# EAGLE design ostc_v3 (EAGLE 6.4)
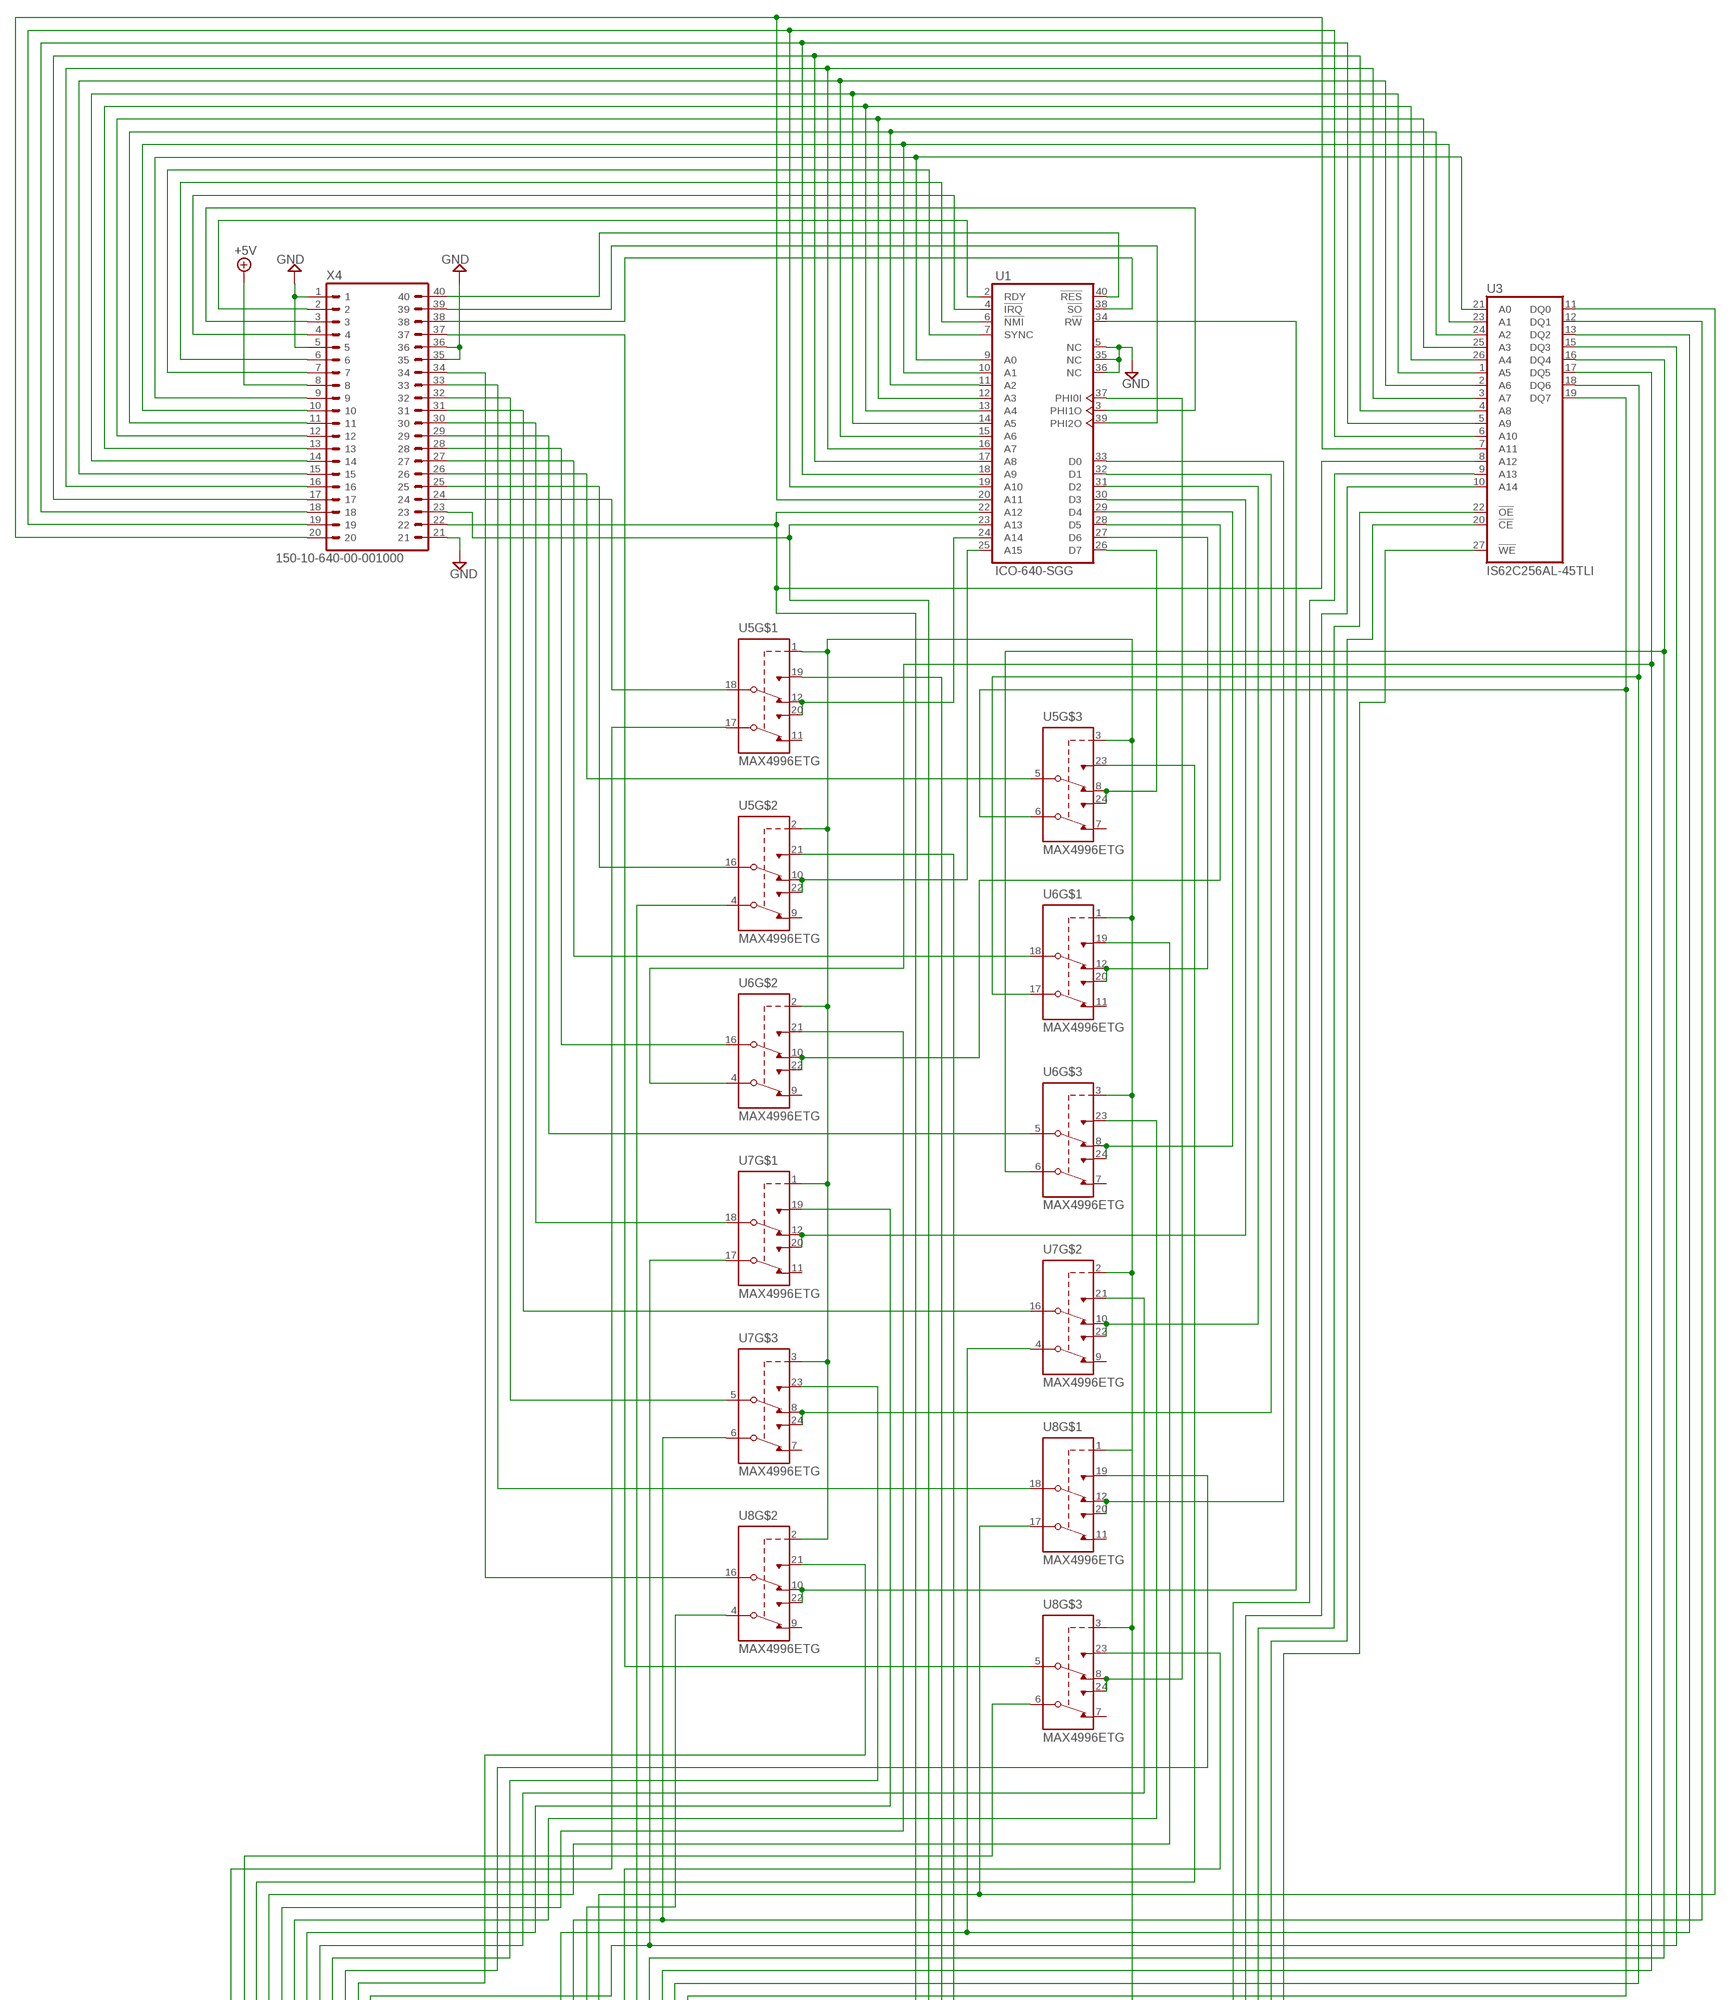
[diagram p0: schematic, sheet 1, part 1 of 2]
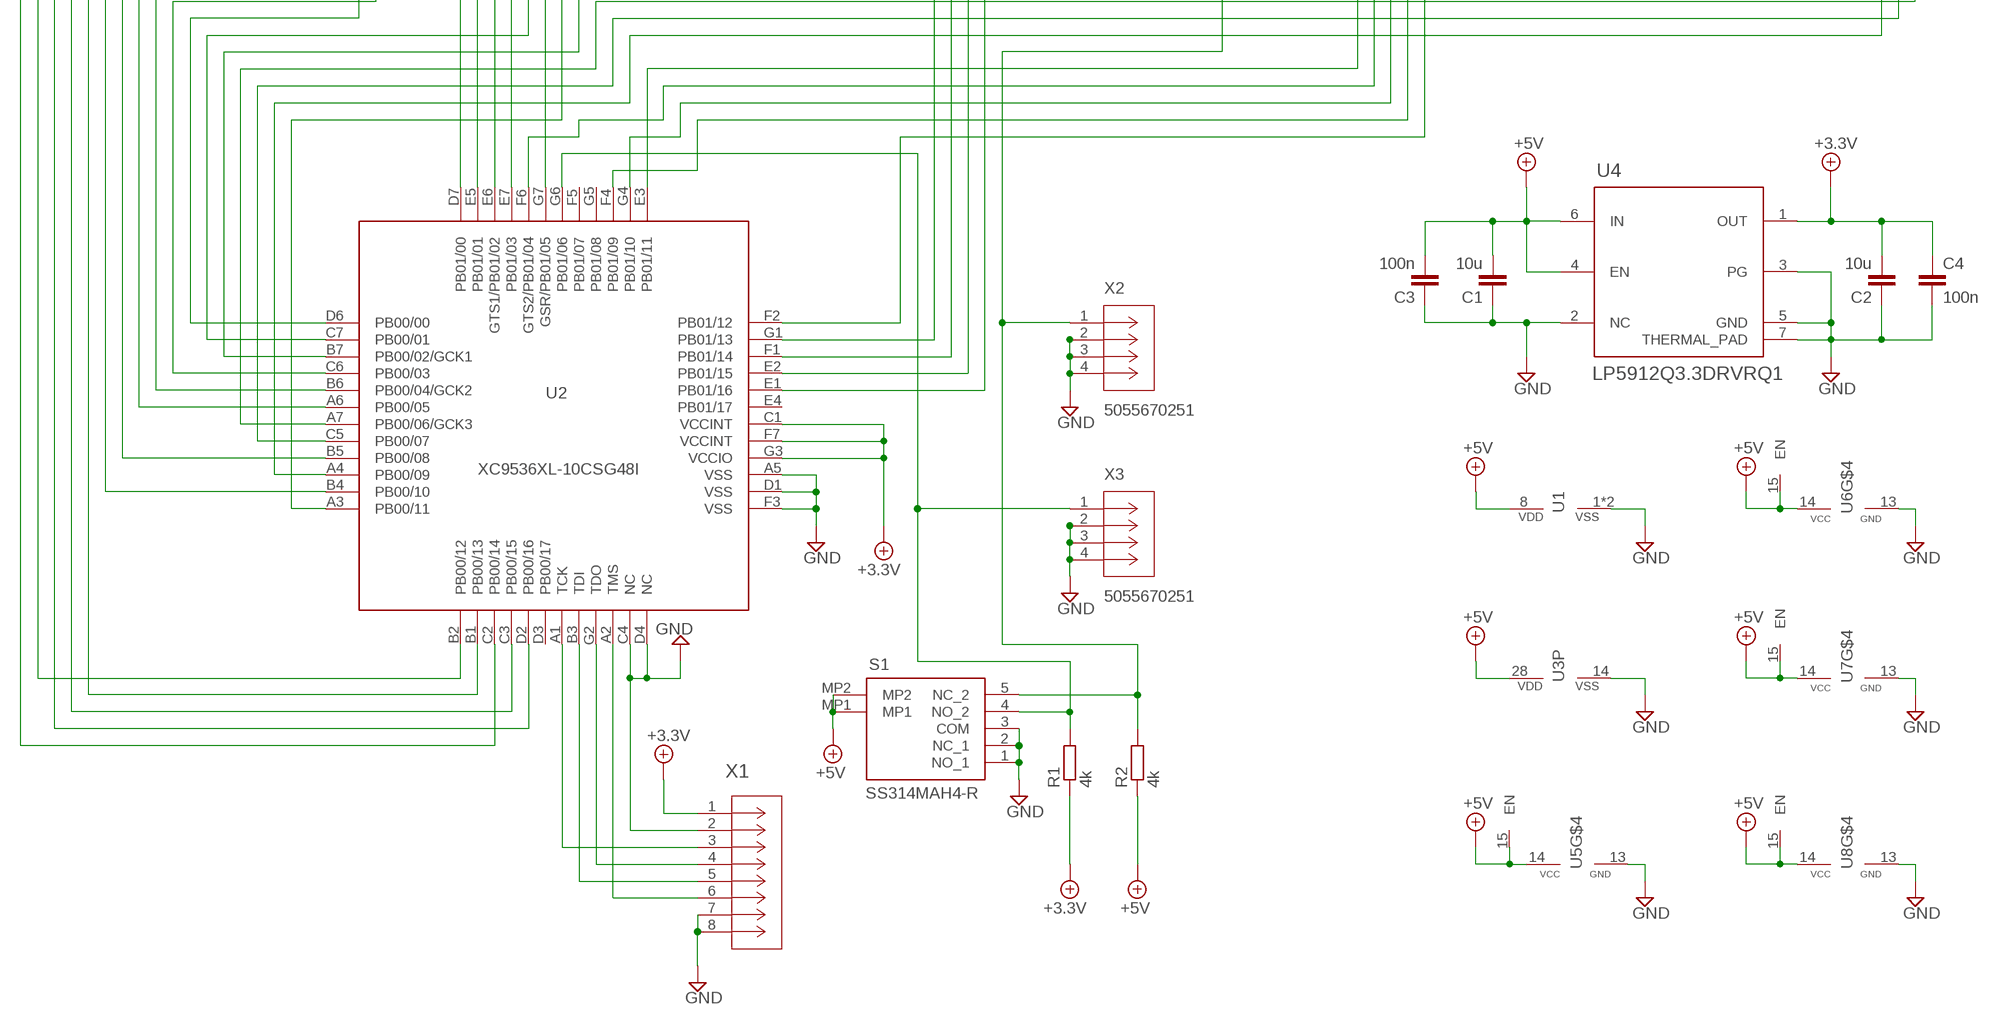
[diagram p1: schematic, sheet 1, part 2 of 2]

## Parts
C1  10u  C-EUC0805  [C0805]
C2  10u  C-EUC0805  [C0805]
C3  100n  C-EUC0805  [C0805]
C4  100n  C-EUC0805  [C0805]
R1  4k  R-EU_R0805  [R0805]
R2  4k  R-EU_R0805  [R0805]
S1  SS314MAH4-R  [SS314MAH4R]
U1  ICO-640-SGG  6502SAMTEC_ICO_C  [DIL40_MICROPROFILE]
U2  XC9536XL-10CSG48I  CX9536_CS48  [CSBGA48]
U3  IS62C256AL-45TLI  CY62256LL-ZC  [TSOP1-28]
U4  LP5912Q3.3DRVRQ1  LP5912-3.0DRVT  [DRV0006A-IPC_A]
U5  MAX4996ETG  [TQFN24]
U6  MAX4996ETG  [TQFN24]
U7  MAX4996ETG  [TQFN24]
U8  MAX4996ETG  [TQFN24]
X1  505567-0651  5055670651  [CON_5055670651]
X2  5055670251  [CON_5055670251]
X3  5055670251  [CON_5055670251]
X4  150-10-640-00-001000  DIL40  [DIL40]

## Nets
+3.3V: C2.2 C4.1 R1.1 U2.C1(VCCINT) U2.F7(VCCINT) U2.G3(VCCIO) U4.1(OUT) X1.1
+5V: C1.2 C3.2 R2.1 S1.MP1 S1.MP2 U1.8(VDD) U3.28(VDD) U4.4(EN) U4.6(IN) U5.14(VCC) U5.15(EN) U6.14(VCC) U6.15(EN) U7.14(VCC) U7.15(EN) U8.14(VCC) U8.15(EN) X4.8
GND: C1.1 C2.1 C3.1 C4.2 S1.1(NO_1) S1.2(NC_1) S1.3(COM) U1.1(VSS) U1.5(NC) U1.21(VSS) U1.35(NC) U1.36(NC) U2.A5(VSS) U2.C4(NC) U2.D1(VSS) U2.D4(NC) U2.F3(VSS) U3.14(VSS) U4.2(NC) U4.3(PG) U4.5(GND) U4.7(THERMAL_PAD) U5.13(GND) U6.13(GND) U7.13(GND) U8.13(GND) X1.2 X1.7 X1.8 X2.2 X2.3 X2.4 X3.2 X3.3 X3.4 X4.1 X4.5 X4.21 X4.35 X4.36
N$1: U1.2(RDY) X4.2
N$2: U1.3(PHI1O) X4.3
N$3: U1.4(!IRQ) X4.4
N$4: U1.6(!NMI) X4.6
N$5: U1.7(SYNC) X4.7
N$6: U1.9(A0) U3.21(A0) X4.9
N$7: U1.10(A1) U3.23(A1) X4.10
N$8: U1.11(A2) U3.24(A2) X4.11
N$9: U1.12(A3) U3.25(A3) X4.12
N$10: U1.13(A4) U3.26(A4) X4.13
N$11: U1.14(A5) U3.1(A5) X4.14
N$12: U1.15(A6) U3.2(A6) X4.15
N$13: U1.16(A7) U3.3(A7) X4.16
N$14: U1.17(A8) U3.4(A8) X4.17
N$15: U1.18(A9) U3.5(A9) X4.18
N$16: U1.19(A10) U3.6(A10) X4.19
N$17: U1.20(A11) U3.7(A11) X4.20
N$18: U2.E2(PB01/15) U5.19(NO1)
N$19: U1.22(A12) U2.G1(PB01/13) U3.8(A12) X4.22
N$20: U1.23(A13) U2.F1(PB01/14) X4.23
N$21: U2.E1(PB01/16) U5.21(NO1)
N$22: U2.D2(PB00/16) U5.23(NO1)
N$23: U2.C3(PB00/15) U6.19(NO1)
N$24: U2.B1(PB00/13) U6.21(NO1)
N$25: U2.B4(PB00/10) U6.23(NO1)
N$26: U2.B5(PB00/08) U7.19(NO1)
N$27: U2.A6(PB00/05) U7.21(NO1)
N$28: U2.B6(PB00/04/GCK2) U7.23(NO1)
N$29: U2.C6(PB00/03) U8.19(NO1)
N$30: U2.D6(PB00/00) U8.21(NO1)
N$31: U8.5(COM1) X4.37
N$32: U1.38(!SO) X4.38
N$33: U1.39(PHI2O) X4.39
N$34: U1.40(!RES) X4.40
N$35: U2.B2(PB00/12) U8.6(COM2)
N$36: U2.E6(GTS1/PB01/02) U8.4(COM2)
N$37: U2.E7(PB01/03) U3.11(DQ0) U8.17(COM2)
N$38: U2.E5(PB01/01) U3.12(DQ1) U7.6(COM2)
N$39: U2.D7(PB01/00) U3.13(DQ2) U7.4(COM2)
N$40: U2.C7(PB00/01) U3.15(DQ3) U7.17(COM2)
N$41: U2.B7(PB00/02/GCK1) U3.16(DQ4) U6.6(COM2)
N$42: U2.A7(PB00/06/GCK3) U3.17(DQ5) U6.4(COM2)
N$43: U2.C5(PB00/07) U3.18(DQ6) U6.17(COM2)
N$44: U2.A4(PB00/09) U3.19(DQ7) U5.6(COM2)
N$45: R1.2 S1.4(NO_2) U2.G6(PB01/06) X3.1
N$46: U1.24(A14) U5.12(NC1) U5.20(NO2)
N$47: U1.26(D7) U5.8(NC1) U5.24(NO2)
N$48: U5.16(COM1) X4.25
N$49: U1.25(A15) U5.10(NC1) U5.22(NO2)
N$50: U5.5(COM1) X4.26
N$51: R2.2 S1.5(NC_2) U5.1(CB) U5.2(CB) U5.3(CB) U6.1(CB) U6.2(CB) U6.3(CB) U7.1(CB) U7.2(CB) U7.3(CB) U8.1(CB) U8.2(CB) U8.3(CB) X2.1
N$52: U6.18(COM1) X4.27
N$53: U2.A3(PB00/11) U5.4(COM2)
N$54: U2.C2(PB00/14) U5.17(COM2)
N$55: U2.A2(TMS) X1.6
N$56: U2.B3(TDI) X1.5
N$57: U2.G2(TDO) X1.4
N$58: U2.A1(TCK) X1.3
N$59: U1.27(D6) U6.12(NC1) U6.20(NO2)
N$60: U5.18(COM1) X4.24
N$61: U6.16(COM1) X4.28
N$62: U1.28(D5) U6.10(NC1) U6.22(NO2)
N$63: U7.16(COM1) X4.31
N$64: U1.29(D4) U6.8(NC1) U6.24(NO2)
N$65: U6.5(COM1) X4.29
N$66: U7.18(COM1) X4.30
N$67: U1.30(D3) U7.12(NC1) U7.20(NO2)
N$68: U1.31(D2) U7.10(NC1) U7.22(NO2)
N$69: U7.5(COM1) X4.32
N$70: U1.32(D1) U7.8(NC1) U7.24(NO2)
N$71: U1.33(D0) U8.12(NC1) U8.20(NO2)
N$72: U8.18(COM1) X4.33
N$73: U8.16(COM1) X4.34
N$74: U1.34(R!W) U8.10(NC1) U8.22(NO2)
N$75: U1.37(PHI0I) U8.8(NC1) U8.24(NO2)
N$76: U2.G7(GSR/PB01/05) U8.23(NO1)
N$77: U2.E3(PB01/11) U3.9(A13)
N$78: U2.F6(GTS2/PB01/04) U3.10(A14)
N$79: U2.G4(PB01/10) U3.22(!OE)
N$80: U2.F4(PB01/09) U3.20(!CE)
N$81: U2.F2(PB01/12) U3.27(!WE)
Unconnected: U2.D3(PB00/17) U2.E4(PB01/17) U2.F5(PB01/07) U2.G5(PB01/08) U5.7(NC2) U5.9(NC2) U5.11(NC2) U6.7(NC2) U6.9(NC2) U6.11(NC2) U7.7(NC2) U7.9(NC2) U7.11(NC2) U8.7(NC2) U8.9(NC2) U8.11(NC2)

## Library data of the parts
C1-C4 = resistor:C-EU: CAPACITOR, European symbol
R1 R2 = resistor:R-EU_: RESISTOR, European symbol
S1 = SS314MAH4-R:SS314MAH4-R: Slide Switches ON-ON-ON .4VA SMT 2MM X 2MM SPACING Source: Datasheet <http://www.nkkswitches.com/pdf/SS3surfaceMount-1.pdf>; DESCRIPTION: Slide Switches ON-ON-ON .4VA SMT 2MM X 2MM SPACING; HEIGHT: 1.4mm; MANUFACTURER_NAME: NKK Switches; MANUFACTURER_PART_NUMBER: SS314MAH4-R; MOUSER_PART_NUMBER: 633-SS314MAH4-R; MOUSER_PRICE-STOCK: https://www.mouser.co.uk/ProductDetail/NKK-Switches/SS314MAH4-R?qs=ICf24S48Y%2FuhNriUiZqPNA%3D%3D
U1 = 6502:6502: R6502 by Rockwell
U2 = xilinx-xc9:CX9536_CS48
U3 = memory-sram:CY62256LL-?*: 256K (32K x 8) CMOS-Static RAM Source: http://download.cypress.com.edgesuite.net/design_resources/datasheets/contents/cy62256_8.pdf
U4 = texas:LP5912-3.0DRVT; COPYRIGHT: Copyright (C) 2024 Ultra Librarian. All rights reserved.; MANUFACTURER_PART_NUMBER: LP5912-3.0DRVT; MFR_NAME: Texas Instruments; REFDES: RefDes; TYPE: TYPE
U5-U8 = maxim:MAX4996ETG*: Triple DPDT, Low Capacitance Data Switches * No exposed pad Source: https://www.analog.com/media/en/technical-documentation/data-sheets/max4996-max4996l.pdf; MPN: MAX4996ETG+; OC_MOUSER: 700-MAX4996ETG
X1 = con-molex:5055670651; COPYRIGHT: Copyright (C) 2024 Ultra Librarian. All rights reserved.; MANUFACTURER_PART_NUMBER: 5055670651; MFR_NAME: Molex Connector Corporation
X2 X3 = con-molex:5055670251; COPYRIGHT: Copyright (C) 2024 Ultra Librarian. All rights reserved.; MANUFACTURER_PART_NUMBER: 5055670251; MFR_NAME: Molex Connector Corporation
X4 = DIL-header:DIL40: DIL Header 40-pin

## Board
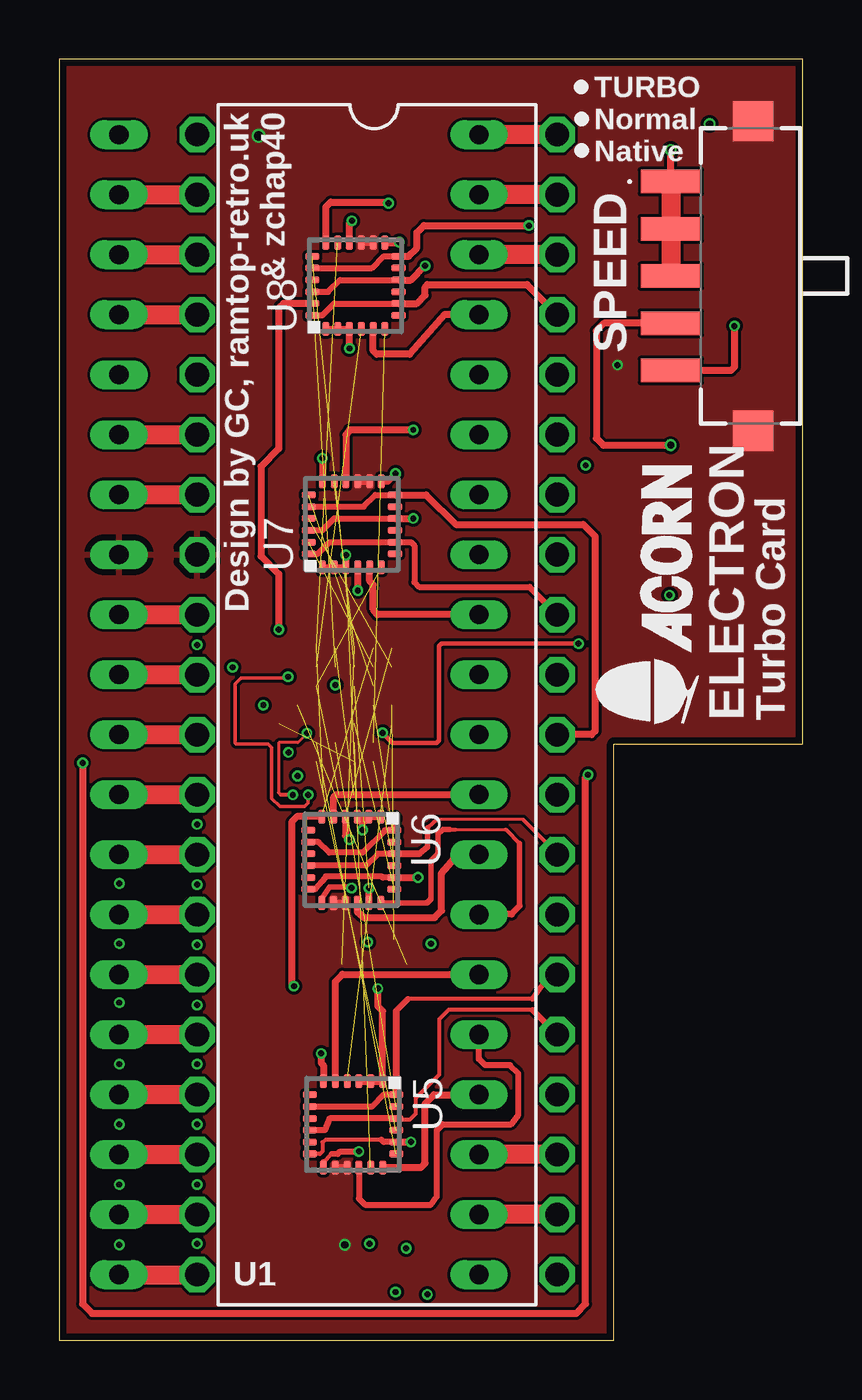
[diagram p2: board, top side]
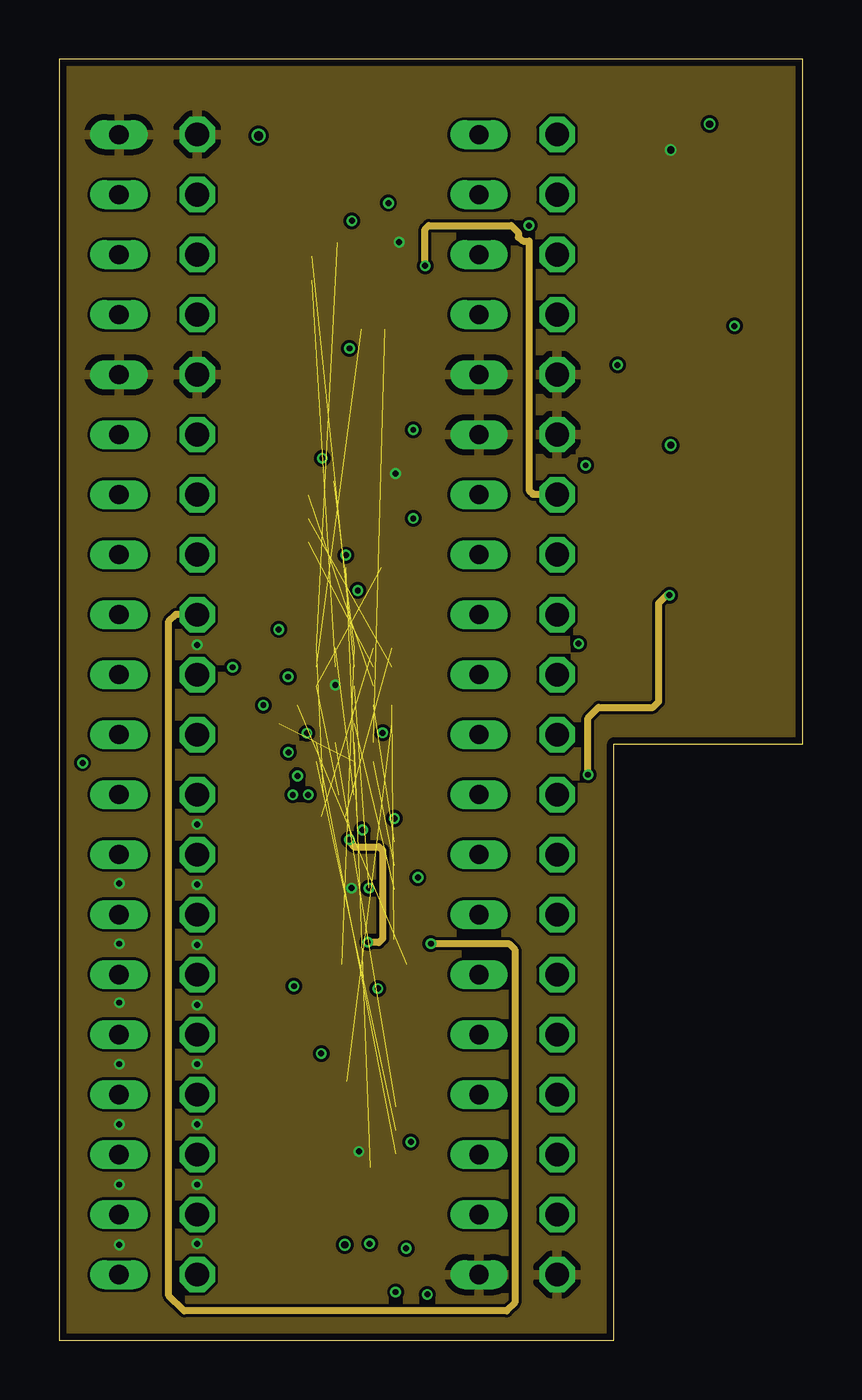
[diagram p3: board, inner layer Route2]
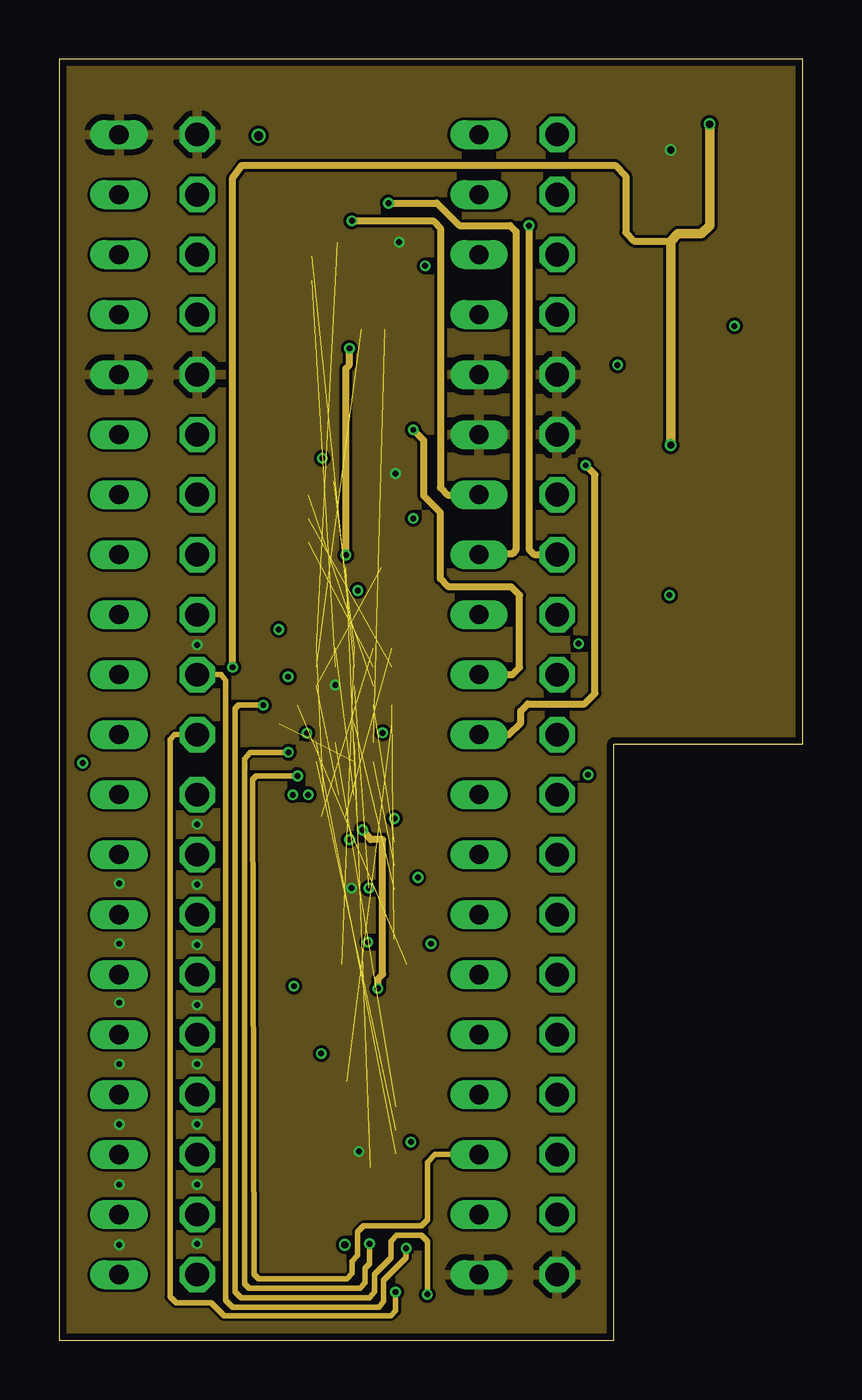
[diagram p4: board, inner layer Route15]
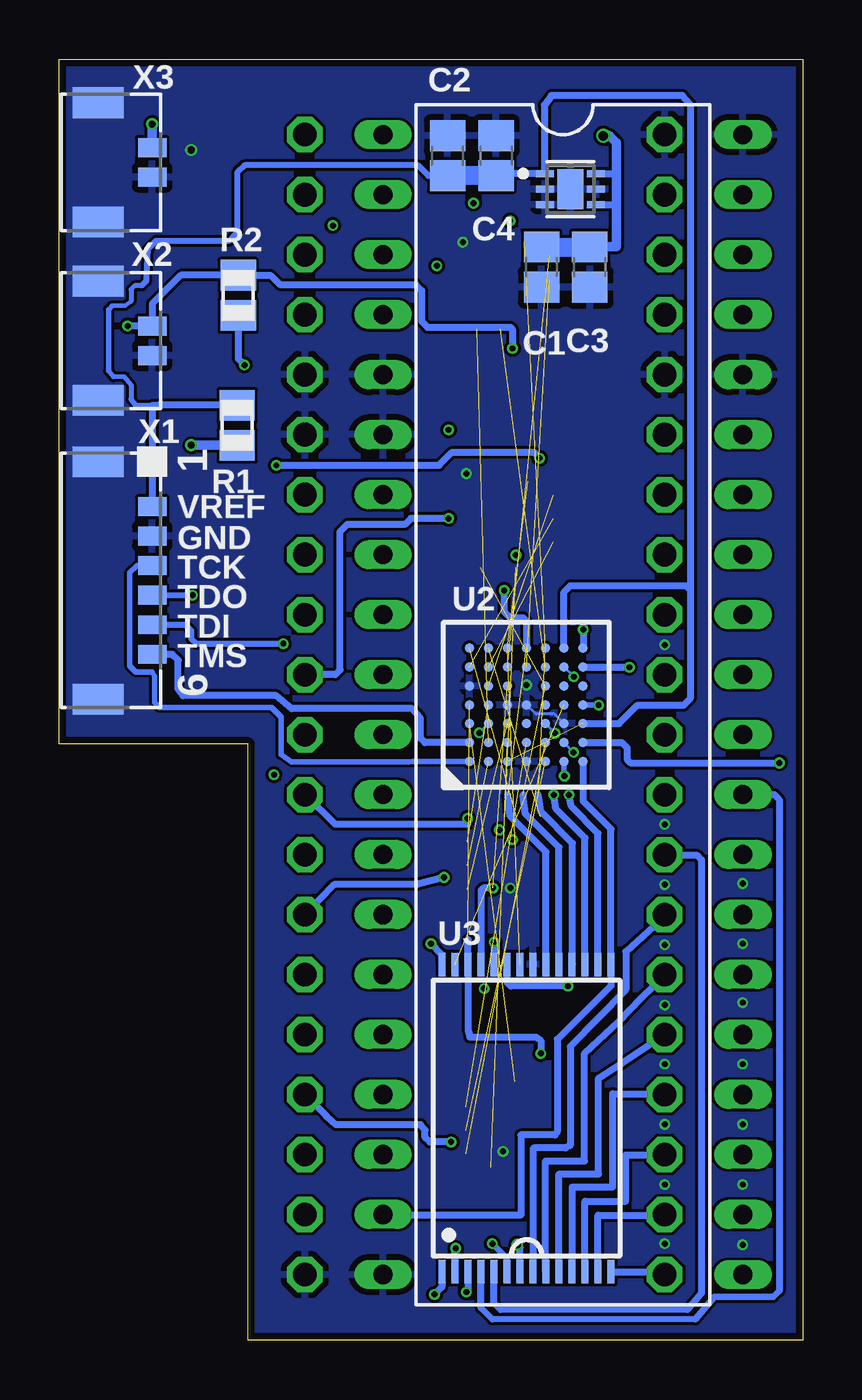
[diagram p5: board, bottom side, seen from below]

Size 31.5 x 54.25 mm. Coordinates in mm from the lower left corner, seen from the top.
Outline: 0,0 23.5,0 23.5,25.25 31.5,25.25 31.5,54.25 0,54.25 0,0
Copper layers (1+2*15+16): Top 0.035mm / dielectric 0.138mm / Route2 0.035mm / dielectric 1.13mm / Route15 0.035mm / dielectric 0.138mm / Bottom 0.035mm
Design rules "aisler_4_layer_complex *": minimum track width 0.125mm, minimum drill 0.1mm, track to track 0.125mm, track to pad 0.125mm, pad to pad 0.125mm, via to via 0.125mm, smd to smd 0mil, copper to edge 0.3mm, drill to drill 0.3mm, minimum pad ring 0.2mm, minimum via ring 0.1mm, stop-mask expansion 0mil, vias tented up to drill 0.3mm, thermal gap 10mil

### Footprints (pad centres in the part's own frame; a part is rotated, then mirrored left to right if it is on the bottom)
C0805 = smd 1.3 x 1.5: 1 -0.85,0; 2 0.85,0
R0805 = smd 1.3 x 1.5: 1 -0.85,0; 2 0.85,0
SS314MAH4R = smd 2.55 x 1: 1 3.1,-4; 2 3.1,-2; 3 3.1,0; 4 3.1,2; 5 3.1,4 | smd 1.7 x 1.7: MP1 -0.375,-6.55; MP2 -0.375,6.55
DIL40_MICROPROFILE = drill 1 octagon: 1 -24.13,-7.62; 2 -21.59,-7.62; 3 -19.05,-7.62; 4 -16.51,-7.62; 5 -13.97,-7.62; 6 -11.43,-7.62; 7 -8.89,-7.62; 8 -6.35,-7.62; 9 -3.81,-7.62; 10 -1.27,-7.62; 11 1.27,-7.62; 12 3.81,-7.62; 13 6.35,-7.62; 14 8.89,-7.62; 15 11.43,-7.62; 16 13.97,-7.62; 17 16.51,-7.62; 18 19.05,-7.62; 19 21.59,-7.62; 20 24.13,-7.62; 21 24.13,7.62; 22 21.59,7.62; 23 19.05,7.62; 24 16.51,7.62; 25 13.97,7.62; 26 11.43,7.62; 27 8.89,7.62; 28 6.35,7.62; 29 3.81,7.62; 30 1.27,7.62; 31 -1.27,7.62; 32 -3.81,7.62; 33 -6.35,7.62; 34 -8.89,7.62; 35 -11.43,7.62; 36 -13.97,7.62; 37 -16.51,7.62; 38 -19.05,7.62; 39 -21.59,7.62; 40 -24.13,7.62
CSBGA48 = smd 0.4 x 0.4: A1 -2,2.8; A2 -1.2,2.8; A3 -0.4,2.8; A4 0.4,2.8; A5 1.2,2.8; A6 2,2.8; A7 2.8,2.8; B1 -2,2; B2 -1.2,2; B3 -0.4,2; B4 0.4,2; B5 1.2,2; B6 2,2; B7 2.8,2; C1 -2,1.2; C2 -1.2,1.2; C3 -0.4,1.2; C4 0.4,1.2; C5 1.2,1.2; C6 2,1.2; C7 2.8,1.2; D1 -2,0.4; D2 -1.2,0.4; D3 -0.4,0.4; D4 0.4,0.4; D6 2,0.4; D7 2.8,0.4; E1 -2,-0.4; E2 -1.2,-0.4; E3 -0.4,-0.4; E4 0.4,-0.4; E5 1.2,-0.4; E6 2,-0.4; E7 2.8,-0.4; F1 -2,-1.2; F2 -1.2,-1.2; F3 -0.4,-1.2; F4 0.4,-1.2; F5 1.2,-1.2; F6 2,-1.2; F7 2.8,-1.2; G1 -2,-2; G2 -1.2,-2; G3 -0.4,-2; G4 0.4,-2; G5 1.2,-2; G6 2,-2; G7 2.8,-2
TSOP1-28 = smd 1 x 0.3: 1 -6.5,-0.275; 2 -6.5,-0.825; 3 -6.5,-1.375; 4 -6.5,-1.925; 5 -6.5,-2.475; 6 -6.5,-3.025; 7 -6.5,-3.575; 8 6.5,-3.575; 9 6.5,-3.025; 10 6.5,-2.475; 11 6.5,-1.925; 12 6.5,-1.375; 13 6.5,-0.825; 14 6.5,-0.275; 15 6.5,0.275; 16 6.5,0.825; 17 6.5,1.375; 18 6.5,1.925; 19 6.5,2.475; 20 6.5,3.025; 21 6.5,3.575; 22 -6.5,3.575; 23 -6.5,3.025; 24 -6.5,2.475; 25 -6.5,1.925; 26 -6.5,1.375; 27 -6.5,0.825; 28 -6.5,0.275
DRV0006A-IPC_A = smd 0.756 x 0.292: 1 -1.078,0.65; 2 -1.078,0; 3 -1.078,-0.65; 4 1.078,-0.65; 5 1.078,0; 6 1.078,0.65 | smd 1.1 x 1.7: 7 0,0
TQFN24 = smd 0.6 x 0.3: 1 -1.825,1.25; 2 -1.825,0.75; 3 -1.825,0.25; 4 -1.825,-0.25; 5 -1.825,-0.75; 6 -1.825,-1.25; 13 1.825,-1.25; 14 1.825,-0.75; 15 1.825,-0.25; 16 1.825,0.25; 17 1.825,0.75; 18 1.825,1.25 | smd 0.3 x 0.6: 7 -1.25,-1.825; 8 -0.75,-1.825; 9 -0.25,-1.825; 10 0.25,-1.825; 11 0.75,-1.825; 12 1.25,-1.825; 19 1.25,1.825; 20 0.75,1.825; 21 0.25,1.825; 22 -0.25,1.825; 23 -0.75,1.825; 24 -1.25,1.825
CON_5055670651 = smd 0.8 x 1.2: 1 0,0; 2 -1.25,0; 3 -2.5,0; 4 -3.75,0; 5 -5,0; 6 -6.25,0 | smd 1.3 x 2.15: 7 1.9,2.295; 8 -8.15,2.295
CON_5055670251 = smd 0.8 x 1.2: 1 0,0; 2 -1.25,0 | smd 1.3 x 2.15: 3 1.9,2.295; 4 -3.15,2.295
DIL40 = drill 0.813 long: 1 -24.13,-7.62; 2 -21.59,-7.62; 3 -19.05,-7.62; 4 -16.51,-7.62; 5 -13.97,-7.62; 6 -11.43,-7.62; 7 -8.89,-7.62; 8 -6.35,-7.62; 9 -3.81,-7.62; 10 -1.27,-7.62; 11 1.27,-7.62; 12 3.81,-7.62; 13 6.35,-7.62; 14 8.89,-7.62; 15 11.43,-7.62; 16 13.97,-7.62; 17 16.51,-7.62; 18 19.05,-7.62; 19 21.59,-7.62; 20 24.13,-7.62; 21 24.13,7.62; 22 21.59,7.62; 23 19.05,7.62; 24 16.51,7.62; 25 13.97,7.62; 26 11.43,7.62; 27 8.89,7.62; 28 6.35,7.62; 29 3.81,7.62; 30 1.27,7.62; 31 -1.27,7.62; 32 -3.81,7.62; 33 -6.35,7.62; 34 -8.89,7.62; 35 -11.43,7.62; 36 -13.97,7.62; 37 -16.51,7.62; 38 -19.05,7.62; 39 -21.59,7.62; 40 -24.13,7.62

### Placement (x,y rotation side)
C1  11.07,45.44 90 bottom
C2  15.04,50.16 270 bottom
C3  9.03,45.44 90 bottom
C4  12.99,50.16 90 bottom
R1  23.96,38.74 270 bottom
R2  23.91,44.25 90 bottom
S1  29.01,45.06 180 top
U1  13.47,26.92 270 top
U2  11.31,26.51 90 bottom
U3  11.7,9.41 90 bottom
U4  9.84,48.74 0 bottom
U5  12.45,9.15 270 top
U6  12.38,20.35 270 top
U7  12.4,34.55 90 top
U8  12.55,44.65 90 top
X1  27.55,35.3 90 bottom
X2  27.55,42.95 90 bottom
X3  27.55,50.5 90 bottom
X4  10.16,26.92 270 top

### Tracks (layer width: path | path; a pad name or v marks a point on that pad's centre or on a via)
+3.3V  (1 unrouted)
  Bottom 0.2: 28.3,44.65 28.45,44.5 | 28.45,44 28.7,43.8 29.25,43.8 | 29.2,40.8 28.75,40.8 28.45,40.45
  Bottom 0.212: 28,44.65 28.3,44.65 | 29.25,43.8 29.4,43.65 | 29.4,41.05 29.2,40.8 | 28.45,40.45 28.45,39.85
  Bottom 0.22: 28.45,44.5 28.45,44
  Bottom 0.223: 27.8,44.85 28,44.65
  Bottom 0.225: 29.4,43.65 29.4,41.05 | 28.45,39.85 28.25,39.59
  Bottom 0.254: C2.2 15.86,49.31 16.3,49.75 23.65,49.75 23.95,49.45 23.95,46.9 24.3,46.55 27.4,46.55 27.75,46.2 27.8,45.1 27.8,44.85 | 28.25,39.59 27.55,39.59
  Bottom 0.305: R1.1 27.31,39.59 27.55,39.59 X1.1 | 12.95,49.27 C4.1 12.9,49.39 U4.1 10.95,49.42 10.95,52.3 10.65,52.7 5.1,52.7 4.75,52.3 4.75,31.75 | U2.G3 7.79,26.11 7,26.9 5.05,26.9 4.75,27.2 4.75,31.75 | U2.F7 10.11,31.69 9.85,31.95 4.95,31.95 4.75,31.75
  Bottom 0.813: C4.1 C2.2
+5V  (via drill 0.25 pad 0.4, 0.3, 0.4 pad 0.4)
  Top 0.305: U5.14 U5.15 | U6.14 U6.15 | U7.15 U7.14 | U8.14 U8.15
  Bottom 0.305: U3.28 11.97,3.92 v12.1,4.05 | U4.6 7.9,49.39 | U4.4 7.92,48.09 7.9,48.15 | R2.1 23.91,41.56 v23.65,41.3
  Bottom 0.406: C3.2 7.9,46.3 7.9,48.15 7.9,49.39 7.9,50.7 8.2,51 v8.45,51
  Bottom 0.813: C1.2 C3.2
  pour Top: 0,54.25 31.5,54.25 31.5,25.25 23.5,25.25 23.5,0 0,0
GND  (via drill 0.25, 0.25 pad 0.4, 0.3)
  Top 0.175: 11.2,7.55 11.55,7.9
  Top 0.225: 11.55,7.9 11.8,7.9 | 11.12,18.73 11.15,18.75 11.45,19.2 12.34,19.2
  Top 0.25: 11.8,7.9 11.9,8
  Top 0.254: U5.13 11.2,7.55 | 11.9,8 v12.7,8 | U6.13 11.12,18.73 | 12.34,19.2 v12.39,19.15
  Top 0.305: U8.13 14.38,46.48 v14.4,46.5 | U7.13 13.93,36.38 v14.25,36.7 | S1.1 25.91,50.39 v25.9,50.4
  Top 0.813: S1.1 S1.2 S1.3
  Bottom 0.125: U2.F3 10.51,26.51 11.3,26.51 U2.D4
  other vias: 11.7,27.75 2.55,19.35 2.55,16.8 2.55,14.3 2.55,11.7 2.55,9.15 2.55,6.6 2.55,4.05 5.85,21.85 5.85,19.3 5.85,16.75 5.85,14.2 5.85,11.7 5.85,9.15 5.85,6.6 5.85,4.1 5.85,29.45
  pour Route15: 0,54.25 31.5,54.25 31.5,25.25 23.5,25.25 23.5,0 0,0
  pour Bottom: 0,54.25 31.5,54.25 31.5,25.25 23.5,25.25 23.5,0 0,0
  pour Route2: 0,0 0,54.25 31.5,54.25 31.5,25.25 23.5,25.25 23.5,0
N$1
  Top 0.813: X4.2 U1.2
N$2
  Top 0.813: X4.3 U1.3
N$3
  Top 0.813: X4.4 U1.4
N$4
  Top 0.813: X4.6 U1.6
N$5
  Top 0.813: X4.7 U1.7
N$6  (via drill 0.25 pad 0.4)
  Top 0.813: X4.9 U1.9
  Route2 0.305: v15.75,16.8 19.05,16.8 19.3,16.55 19.3,1.6 18.95,1.25 5.3,1.25 4.65,1.9 4.65,30.45 4.95,30.75 5.83,30.75 U1.9
  Bottom 0.305: U3.21 15.28,16.32 v15.75,16.8
N$7  (via drill 0.25 pad 0.4)
  Top 0.813: X4.10 U1.10
  Route15 0.225: v14.7,3.9 14.7,3.5 13.75,2.55 13.75,1.65 13.55,1.4 7.35,1.4 7.05,1.7 7.05,27.95 6.86,28.19 U1.10
  Bottom 0.305: U3.23 14.72,3.88 v14.7,3.9
N$8  (via drill 0.25 pad 0.4)
  Top 0.813: X4.11 U1.11
  Route15 0.225: v14.25,2.05 14.25,1.25 14.05,1.05 7,1.05 6.45,1.6 4.95,1.6 4.7,1.85 4.7,25.45 4.9,25.65 U1.11
  Bottom 0.305: U3.24 14.18,2.12 v14.25,2.05
N$9
  Top 0.813: X4.12 U1.12
  Bottom 0.25: 4.55,0.9 13.15,0.9
  Bottom 0.275: 1,2.1 1.25,1.85 3.75,1.85 4.55,0.9 | 13.15,0.9 13.62,1.38
  Bottom 0.305: 1,2.1 1,22.9 1.2,23.1 X4.12 | 13.62,1.38 U3.25
N$10
  Top 0.813: X4.13 U1.13
  Bottom 0.25: 4.9,1.3 12.8,1.3
  Bottom 0.275: 4.3,2 4.9,1.3 | 12.8,1.3 13.07,1.57
  Bottom 0.305: U1.13 5.83,20.55 4.5,20.55 4.3,20.35 4.3,2 | 13.07,1.57 U3.26
N$11
  Top 0.813: X4.14 U1.14
  Bottom 0.305: U1.14 5.85,17.95 7.5,16.45 7.5,14.85 9.85,12.45 9.85,8.25 10.05,8.15 11.4,8.15 11.43,8.12 U3.1
N$12
  Top 0.813: X4.15 U1.15
  Bottom 0.305: U3.2 10.9,2.91 10.9,7.6 9.25,7.6 9.25,12.15 7.8,13.5 6.85,14.5 5.85,15.45 U1.15
N$13
  Top 0.813: X4.16 U1.16
  Bottom 0.305: U3.3 10.33,7.05 8.65,7.05 8.65,11.1 7.7,11.7 U1.16
N$14
  Top 0.813: X4.17 U1.17
  Bottom 0.305: U3.4 9.77,6.5 8.05,6.5 8.05,10.45 5.85,10.45 U1.17
N$15
  Top 0.813: X4.18 U1.18
  Bottom 0.305: U3.5 9.23,5.9 7.5,5.9 7.5,7.85 5.85,7.85 U1.18
N$16
  Top 0.813: X4.19 U1.19
  Bottom 0.305: U3.6 8.68,5.3 5.85,5.3 U1.19
N$17
  Top 0.813: X4.20 U1.20
  Bottom 0.305: U3.7 5.85,2.91
  Bottom 0.406: 5.85,2.91 U1.20
N$18  (1 unrouted)
N$19
  Top 0.813: U1.22 X4.22
  Bottom 0.305: U3.8 8.13,21.65 9.31,22.83 U2.G1 | U3.8 | U3.8 8.13,15.02 10.4,12.75 10.4,8.85 10.5,8.7 11.95,8.7 11.95,5.3 17.75,5.3 X4.22
N$20  (via drill 0.25 pad 0.4)
  Top 0.813: U1.23 X4.23
  Route15 0.225: X4.23 15.92,7.87 15.6,7.55 15.6,5.1 15.35,4.85 12.9,4.85 12.65,4.6 12.65,3.6 12.4,3.35 12.4,2.85 12.2,2.6 8.45,2.6 8.25,2.8 8.2,23.75 8.35,23.9 v10.1,23.9
  Bottom 0.225: U2.F1 v10.11,23.91 v10.1,23.9
N$21  (1 unrouted)
N$22  (1 unrouted)
N$23  (1 unrouted)
N$24  (1 unrouted)
N$25  (1 unrouted)
N$26  (1 unrouted)
N$27  (1 unrouted)
N$28  (1 unrouted)
N$29  (1 unrouted)
N$30  (1 unrouted)
N$31
  Top 0.305: X4.37 16.33,43.43 14.85,41.75 13.45,41.75 13.3,41.9 U8.5
N$32
  Top 0.813: U1.38 X4.38
N$33
  Top 0.813: U1.39 X4.39
N$34
  Top 0.813: U1.40 X4.40
N$35  (1 unrouted)
N$36  (1 unrouted)
N$37  (2 unrouted)
  Bottom 0.15: 9.75,15.94 U3.11
  Bottom 0.305: 9.75,15.94 9.75,21.05 11.1,22.4 11.2,23.1
N$38  (2 unrouted)
  Bottom 0.305: U3.12 10.32,20.88 11.75,22.3 11.85,23.1
N$39  (via drill 0.25 pad 0.4)  (1 unrouted)
  Top 0.305: U7.4 v12.65,31.75
  Bottom 0.305: U3.13 10.88,20.68 12.4,22.2 12.5,23.1 | v12.65,31.75 12.65,30.85 12.4,30.6 11.85,30.6 11.71,30.46 U2.D7
N$40  (2 unrouted)
N$41  (via drill 0.25 pad 0.4)  (1 unrouted)
  Top 0.305: U6.6 10.07,22.18 9.85,21.95 9.85,15.1 v9.95,15
  Bottom 0.305: v9.95,15 12.38,15 12.53,15.15 U3.16
N$42  (via drill 0.25 pad 0.4)  (1 unrouted)
  Top 0.305: U6.4 12.12,21.38 v12.3,21.2
  Route2 0.305: v12.3,21.2 12.3,21.1 12.5,20.9 13.55,20.9 13.7,20.75 13.7,17 13.55,16.85 13.09,16.85 v13.07,16.86
  Bottom 0.305: 13.08,15.98 U3.17 v13.07,16.86
N$43  (via drill 0.25 pad 0.4)  (1 unrouted)
  Top 0.305: U6.17 v13.12,19.15
  Bottom 0.305: 13.63,15.94 U3.18 13.62,19.06 13.54,19.15 v13.12,19.15
N$44  (via drill 0.25)  (1 unrouted)
  Top 0.305: v11.1,12.15 11.1,11.75 11.2,11.65 U5.6
  Bottom 0.305: v11.1,12.15 11.1,12.7 11.3,12.85 14.1,12.85 14.18,13.12 U3.19 14.18,16.98
N$45  (via drill 0.25 pad 0.4, 0.3)
  Top 0.305: S1.4 23.06,43.06 22.75,42.75 22.75,38.2 23.05,37.9 v25.9,37.9
  Route15 0.305: v7.35,28.5 7.35,49.2 7.75,49.75 23.55,49.75 24,49.3 24,46.9 24.35,46.55 25.9,46.55
  Route15 0.406: v27.55,51.5 27.55,47.2 27.2,46.85 26.2,46.85 25.9,46.55 v25.9,37.9
  Bottom 0.305: U2.G6 v7.36,28.51 v7.35,28.5
  Bottom 0.406: X3.1 v27.55,51.5 | v25.9,37.9 R1.2
N$46  (via drill 0.25)
  Top 0.175: 13.65,8.5 11.3,8.5 11.15,8.4 11.15,8 11.05,7.9 U5.12
  Top 0.254: U5.20 13.75,8.4 13.65,8.5
  Top 0.305: U5.20 v14.9,8.4
  Bottom 0.305: v14.9,8.4 15.8,8.4 16,8.6 16,8.9 16.19,9.14 19.77,9.14 20.14,9.45 20.2,9.52 U1.24
N$47
  Top 0.175: 20.05,14.45 14.78,14.45
  Top 0.225: 20.79,15.49 20.05,14.45 | 14.78,14.45 14.28,13.95
  Top 0.254: U5.24 13.75,10.4 13.25,9.9 U5.8
  Top 0.275: U1.26 20.79,15.49
  Top 0.305: 14.28,13.95 U5.24
N$48
  Top 0.254: U5.16 12.7,6 12.95,5.75 15.75,5.75 16,6.1 16,8.9 16.25,9.15 19.15,9.15 19.45,9.55 19.45,11.3 19.1,11.65 18.05,11.65 17.78,11.92 X4.25
N$49
  Top 0.125: 14.32,9.35 U5.22
  Top 0.175: 20.05,14 16.5,14 16.1,13.6 16.1,11.25 15.1,10.25 15.1,9.6 14.85,9.35 14.32,9.35
  Top 0.225: U1.25 20.05,14
  Top 0.254: U5.22 11.45,9.4 11.25,8.9 U5.10
  Top 0.275: U1.25
N$50
  Top 0.305: U5.5 11.7,15.2 12,15.5 X4.26
N$51  (via drill 0.25 pad 0.4)  (1 unrouted)
  Top 0.305: U5.1 U5.2 U5.3 U5.1 | U7.1 U7.2 U7.3 v12.15,33.25 | U8.1 U8.2 U8.3 v12.3,42 | U6.3 U6.2 | U6.2 U6.1 | v28.6,42.95 28.6,41.21 28.45,41.06 S1.5 | U5.1 13.7,13.95 13.5,14.15 v13.5,14.9 | v12.85,21.61 12.85,21.9 U6.2
  Route15 0.305: v12.15,33.25 12.15,41.15 12.3,41.3 v12.3,42 | v13.5,14.9 13.5,15.3 13.7,15.5 13.7,21.2 13.2,21.2 v12.85,21.61
  Bottom 0.305: v28.6,42.95 X2.1 27.55,43.9 26.35,45.1 R2.2 22.55,45.1 22.15,44.7 16.4,44.7 16.15,44.45 16.15,43.15 15.9,42.9 12.38,42.9 U8.3 v12.3,42
N$52
  Top 0.125: 16.79,21.62 18.93,21.62
  Top 0.175: 16.52,21.62 16.79,21.62 | 18.93,21.62 19.5,21.05
  Top 0.225: U6.18 15.57,18.52 15.75,18.7 15.75,20.3 16.05,20.6 16.05,21.45 16.25,21.62 16.52,21.62 | 19.5,21.05 19.5,18.4
  Top 0.275: 19.5,18.4 19.16,18.05
  Top 0.305: 19.16,18.05 X4.27
N$53  (1 unrouted)
N$54  (1 unrouted)
N$55
  Bottom 0.305: U2.A2 16.01,25.31 16.2,25.5 16.2,26.35 16.55,26.75 21.65,26.75 22.3,27.3 26.25,27.3 26.45,27.55 26.45,28.8 26.7,29.05 X1.6
N$56  (via drill 0.25 pad 0.4)
  Top 0.2: v13.7,25.73 14.12,25.3 15.97,25.3 16.1,25.4 16.1,29.4 16.2,29.5 v22,29.5
  Bottom 0.125: U2.B3 13.34,26.11 v13.7,25.73
  Bottom 0.254: X1.5 26.15,30.3 25.9,30.05 25.9,29.7 25.7,29.5 v22,29.5
N$57  (via drill 0.25 pad 0.4)
  Top 0.305: v1,24.45 1,1.55 1.4,1.15 21.9,1.15 22.3,1.55 22.3,23.85 v22.4,23.95
  Route2 0.305: v22.4,23.95 22.4,26.35 22.85,26.8 25.15,26.8 25.4,27.05 25.4,31.21 25.73,31.55 v25.85,31.55
  Bottom 0.254: X1.4 v25.85,31.55
  Bottom 0.305: U2.G2 7.66,25.31 7.45,25.1 7.45,24.6 7.3,24.45 v1,24.45
N$58
  Bottom 0.225: U2.A1 16.54,24.51 16.7,24.5 21.65,24.5 22.1,24.8 22.1,26.4 22.5,26.8 27.25,26.8 27.45,27 27.45,28.1 27.55,28.3 28.25,28.3 28.5,28.55 28.5,32.5 28.2,32.8 X1.3
N$59  (via drill 0.25 pad 0.4)
  Top 0.254: U6.20 13.7,19.6 13.65,19.65 11.3,19.65 11.15,19.45 10.85,19.1 U6.12
  Top 0.305: U6.20 v15.2,19.6
  Bottom 0.305: v15.2,19.6 16.35,19.3 19.85,19.3 U1.27
N$60
  Top 0.305: U5.18 15.32,7.33 15.5,7.5 15.5,10.03 15.88,10.4 X4.24
N$61
  Top 0.305: U6.16 12.62,18.15 12.9,17.9 15.9,17.9 16.2,18.2 16.2,19.8 16.88,20.57 X4.28
N$62
  Top 0.125: 19.65,22.05 16,22.05
  Top 0.175: 21.09,20.61 19.65,22.05 | 16,22.05 15.6,21.7
  Top 0.225: U1.28 21.09,20.61 | 15.6,21.7 15.6,20.9
  Top 0.25: 15.6,20.9 15.25,20.6
  Top 0.254: U6.22 13.5,20.6 13,20.1 U6.10
  Top 0.305: 15.25,20.6 U6.22
N$63  (via drill 0.25 pad 0.4)
  Top 0.305: v15,38.55 12.3,38.55 12.15,38.35 U7.16
  Route15 0.305: X4.31 19.19,28.19 19.5,28.5 19.5,31.55 19.15,31.9 16.5,31.9 16.15,32.25 16.15,35.05 15.45,35.75 15.45,38.1 v15,38.55
N$64  (via drill 0.25)
  Top 0.254: U6.24 13.8,21.6 12.85,20.65 11.45,20.65 11,21.1 U6.8
  Top 0.305: U6.24 v14.2,22.1
  Bottom 0.305: v14.2,22.1 14.2,21.85 19.8,21.85 U1.29
N$65
  Top 0.305: U6.5 11.62,23 11.74,23.11 X4.29
N$66  (via drill 0.25 pad 0.4)
  Top 0.305: v11.15,37.35 U7.18
  Route15 0.305: X4.30 19.05,25.65 19.55,26.15 19.55,26.65 19.85,26.95 22.25,26.95 22.7,27.4 22.7,36.65 v22.3,37.05
  Bottom 0.305: v22.3,37.05 15.4,37.05 14.85,37.6 11.4,37.6 v11.15,37.35
N$67
  Top 0.254: U7.20 12.9,35.3 13.4,35.8 U7.12
  Top 0.305: U7.12 15.55,35.8 16.8,34.55 22.2,34.55 22.7,34.05 22.7,25.8 22.55,25.65 U1.30
N$68  (via drill 0.25 pad 0.4)
  Top 0.254: U7.22 11.15,34.3 11.65,34.8 U7.10
  Top 0.305: U7.10 v15,34.8
  Bottom 0.305: v15,34.8 16.6,34.8 16.85,34.55 19.3,34.55 19.6,34.25 19.6,28.39 19.8,28.19 U1.31
N$69
  Top 0.305: X4.32 13.47,30.73 13.3,30.95 13.3,32 13.15,32.15 U7.5
N$70
  Top 0.254: U7.24 10.95,33.3 11.45,33.8 U7.8 14.9,33.8 15.05,33.65 15.05,32.1 15.25,31.9 19.92,31.9 U1.32
N$71  (via drill 0.25 pad 0.4)
  Top 0.254: U8.20 13.25,45.4 13.75,45.9 U8.12
  Top 0.305: U8.12 14.8,45.9 15.15,46.25 15.15,46.9 15.45,47.2 v19.9,47.2
  Route15 0.305: v19.9,47.2 19.9,33.49 20.11,33.27 U1.33
N$72  (via drill 0.25 pad 0.4)
  Top 0.305: U8.18 11.3,48 11.5,48.2 13.9,48.2 v13.95,48.15
  Route15 0.305: v13.95,48.15 16,48.15 16.95,47.2 19.1,47.2 19.35,46.95 19.35,33.49 19.2,33.3 17.79,33.3 X4.33
N$73  (via drill 0.25 pad 0.4)
  Top 0.305: U8.16 12.3,47.3 v12.4,47.4
  Route15 0.305: v12.4,47.4 15.85,47.4 16.15,47.1 16.15,36.1 16.45,35.8 X4.34
N$74  (via drill 0.25 pad 0.4)
  Top 0.254: U8.22 11.4,44.4 11.9,44.9 U8.10
  Top 0.305: U8.10 14.9,44.9 v15.5,45.5
  Route2 0.305: v15.5,45.5 15.5,47.05 15.65,47.2 19.15,47.2 19.45,46.9 19.45,46.7 19.65,46.55 19.9,46.55 19.9,35.99 20.06,35.83 21.07,35.83 U1.34
N$75
  Top 0.254: U8.24 11.15,43.4 11.65,43.9 U8.8
  Top 0.305: U8.8 15.15,43.9 15.5,44.25 15.5,44.6 15.6,44.7 19.82,44.7 U1.37
N$76  (via drill 0.25 pad 0.4)
  Top 0.305: U8.23 9.5,43.9 9.3,43.7 9.3,37.75 8.55,37 8.55,33.2 9.3,32.45 v9.3,30.1
  Bottom 0.305: v9.3,30.1 U2.G7
N$77  (via drill 0.25 pad 0.4)
  Top 0.125: v10.5,25.71 10.11,25.31 9.3,25.31 9.3,23.2
  Top 0.15: 9.4,23.1 9.3,23.2
  Top 0.175: v9.9,23.1 9.4,23.1
  Bottom 0.125: U2.E3 v10.5,25.71
  Bottom 0.305: U3.9 8.68,21.48 9.8,22.6 v9.9,23.1
N$78  (via drill 0.25 pad 0.4)
  Top 0.15: v10.55,23.1 10.55,22.75 10.4,22.6 9.35,22.6 9,22.95 9,25.1 8.85,25.25 7.5,25.25 7.45,25.3 7.45,27.8 7.7,28.05 9.65,28.05 v9.7,28.1
  Bottom 0.125: v9.7,28.1 U2.F6
  Bottom 0.305: U3.10 9.22,21.27 10.45,22.5 v10.55,23.1
N$79  (via drill 0.25 pad 0.4)
  Route15 0.225: v15.6,1.95 15.6,4.2 15.35,4.45 14.3,4.45 14.05,4.2 14.05,3.5 13.35,2.8 13.35,2.05 13.15,1.8 7.7,1.8 7.45,2.05 7.45,26.75 7.6,26.9 v8.65,26.9
  Bottom 0.225: v8.65,26.9 U2.G4
  Bottom 0.305: U3.22 15.28,2.33 15.3,2.3 15.3,2.25 v15.6,1.95
N$80  (1 unrouted)
N$81  (via drill 0.25 pad 0.4)
  Route15 0.225: v13.15,4.1 13.15,3.25 12.95,3.05 12.95,2.45 12.75,2.2 8.05,2.2 7.85,2.4 7.85,24.62 8.09,24.9 v9.71,24.9
  Bottom 0.125: U2.F2 v9.71,24.9
  Bottom 0.225: U3.27 12.53,3.48 v13.15,4.1

### Text on the board
tNames: Design by GC, ramtop-retro.uk / & zchap40 | TURBO / Normal / Native | SPEED | ELECTRON | Turbo Card
bNames: 1 | VREF | GND | TCK | TDO | TDI | 6 | TMS